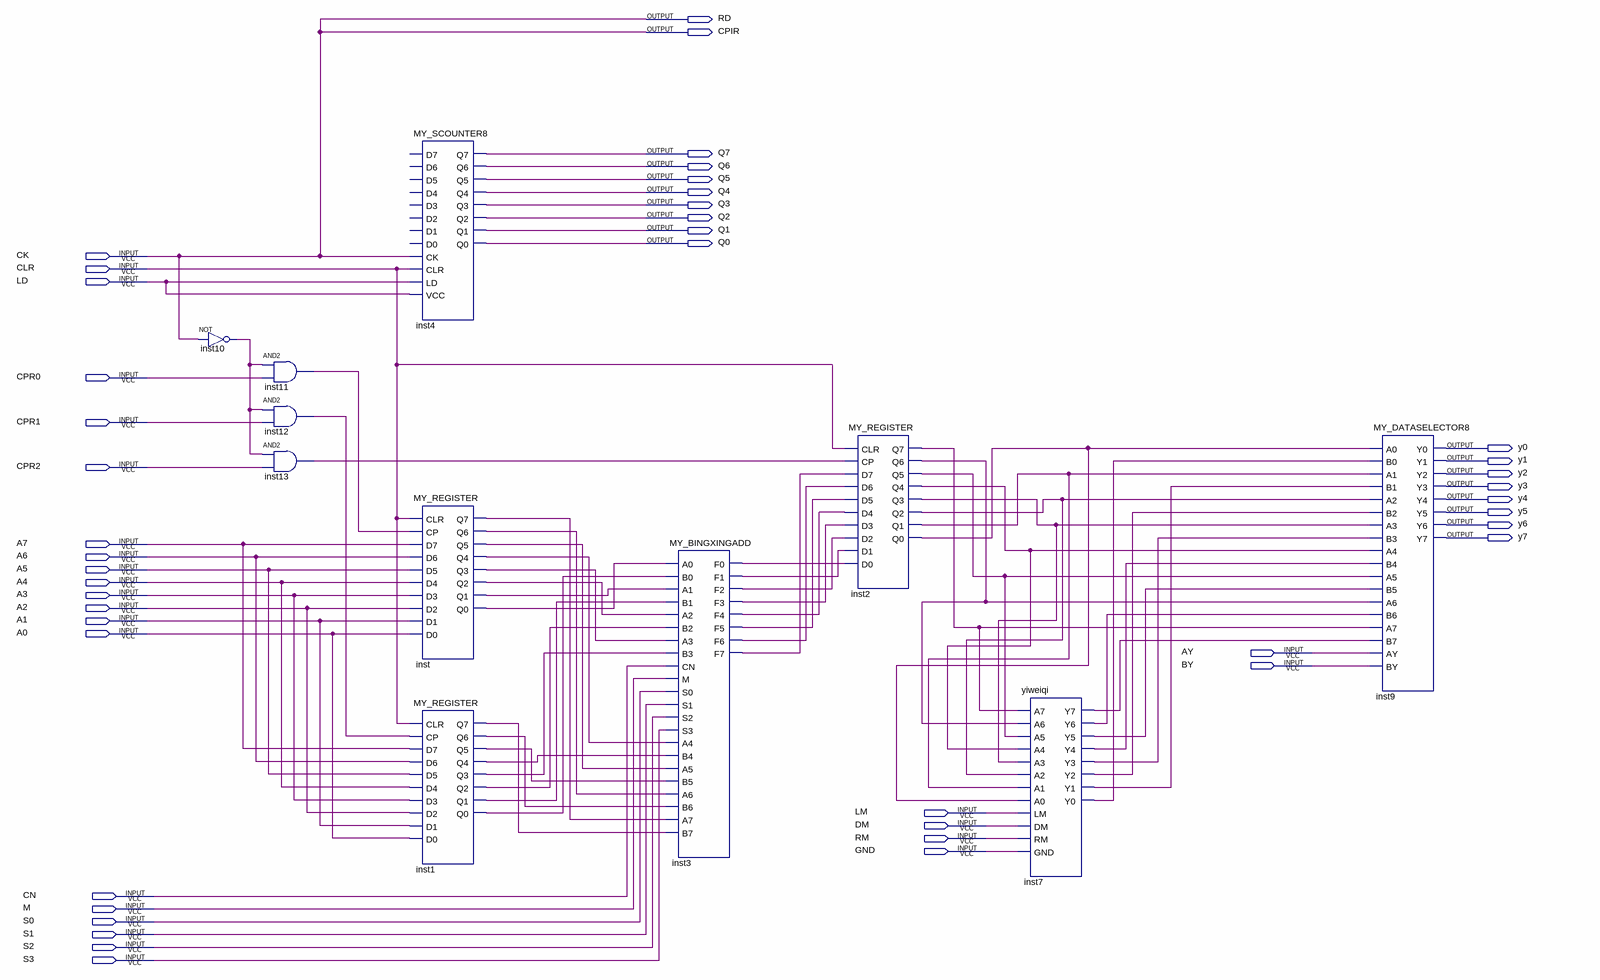
[diagram p0: schematic sheet]
// Quartus schematic MY_CONTROLEDADD.bdf as structural Verilog: 11 symbols, 44 pins
module MY_CONTROLEDADD (
  input  CK,
  input  CLR,
  input  LD,
  input  CPR0,
  input  CPR1,
  input  CPR2,
  input  A7,
  input  A6,
  input  A5,
  input  A4,
  input  A3,
  input  A2,
  input  A1,
  input  A0,
  input  AY,
  input  BY,
  input  LM,
  input  DM,
  input  RM,
  input  GND,
  input  CN,
  input  M,
  input  S0,
  input  S1,
  input  S2,
  input  S3,
  output RD,
  output CPIR,
  output Q7,
  output Q6,
  output Q5,
  output Q4,
  output Q3,
  output Q2,
  output Q1,
  output Q0,
  output y0,
  output y1,
  output y2,
  output y3,
  output y4,
  output y5,
  output y6,
  output y7
);

  wire inst1_q0, inst1_q1, inst1_q2, inst1_q3, inst1_q4, inst1_q5, inst1_q6, inst1_q7, inst2_q0, inst2_q1,
       inst2_q2, inst2_q3, inst2_q4, inst2_q5, inst2_q6, inst2_q7, inst3_f0, inst3_f1, inst3_f2, inst3_f3,
       inst3_f4, inst3_f5, inst3_f6, inst3_f7, inst7_y0, inst7_y1, inst7_y2, inst7_y3, inst7_y4, inst7_y5,
       inst7_y6, inst7_y7, inst10_out, inst11_out, inst12_out, inst13_out, inst_q0, inst_q1, inst_q2,
       inst_q3, inst_q4, inst_q5, inst_q6, inst_q7;

  not inst10 (inst10_out, CK);
  and inst11 (inst11_out, inst10_out, CPR0);
  and inst12 (inst12_out, inst10_out, CPR1);
  and inst13 (inst13_out, inst10_out, CPR2);
  MY_SCOUNTER8 inst4 (
    .CK(CK), .CLR(CLR), .LD(LD), .VCC(LD), .Q7(Q7), .Q6(Q6), .Q5(Q5), .Q4(Q4), .Q3(Q3), .Q2(Q2), .Q1(Q1),
    .Q0(Q0));  // open: D7, D6, D5, D4, D3, D2, D1, D0
  MY_REGISTER inst (
    .CLR(CLR), .CP(inst11_out), .D7(A7), .D6(A6), .D5(A5), .D4(A4), .D3(A3), .D2(A2), .D1(A1), .D0(A0),
    .Q7(inst_q7), .Q6(inst_q6), .Q5(inst_q5), .Q4(inst_q4), .Q3(inst_q3), .Q2(inst_q2), .Q1(inst_q1),
    .Q0(inst_q0));
  MY_REGISTER inst1 (
    .CLR(CLR), .CP(inst12_out), .D7(A7), .D6(A6), .D5(A5), .D4(A4), .D3(A3), .D2(A2), .D1(A1), .D0(A0),
    .Q7(inst1_q7), .Q6(inst1_q6), .Q5(inst1_q5), .Q4(inst1_q4), .Q3(inst1_q3), .Q2(inst1_q2), .Q1(inst1_q1),
    .Q0(inst1_q0));
  MY_BINGXINGADD inst3 (
    .A0(inst_q0), .B0(inst1_q0), .A1(inst_q1), .B1(inst1_q1), .A2(inst_q2), .B2(inst1_q2), .A3(inst_q3),
    .B3(inst1_q3), .CN(CN), .M(M), .S0(S0), .S1(S1), .S2(S2), .S3(S3), .A4(inst_q4), .B4(inst1_q4),
    .A5(inst_q5), .B5(inst1_q5), .A6(inst_q6), .B6(inst1_q6), .A7(inst_q7), .B7(inst1_q7), .F0(inst3_f0),
    .F1(inst3_f1), .F2(inst3_f2), .F3(inst3_f3), .F4(inst3_f4), .F5(inst3_f5), .F6(inst3_f6), .F7(inst3_f7));
  MY_REGISTER inst2 (
    .CLR(CLR), .CP(inst13_out), .D7(inst3_f7), .D6(inst3_f6), .D5(inst3_f5), .D4(inst3_f4), .D3(inst3_f3),
    .D2(inst3_f2), .D1(inst3_f1), .D0(inst3_f0), .Q7(inst2_q7), .Q6(inst2_q6), .Q5(inst2_q5), .Q4(inst2_q4),
    .Q3(inst2_q3), .Q2(inst2_q2), .Q1(inst2_q1), .Q0(inst2_q0));
  yiweiqi inst7 (
    .A7(inst2_q7), .A6(inst2_q6), .A5(inst2_q5), .A4(inst2_q4), .A3(inst2_q3), .A2(inst2_q2), .A1(inst2_q1),
    .A0(inst2_q0), .LM(LM), .DM(DM), .RM(RM), .GND(GND), .Y7(inst7_y7), .Y6(inst7_y6), .Y5(inst7_y5),
    .Y4(inst7_y4), .Y3(inst7_y3), .Y2(inst7_y2), .Y1(inst7_y1), .Y0(inst7_y0));
  MY_DATASELECTOR8 inst9 (
    .A0(inst2_q0), .B0(inst7_y0), .A1(inst2_q1), .B1(inst7_y1), .A2(inst2_q2), .B2(inst7_y2), .A3(inst2_q3),
    .B3(inst7_y3), .A4(inst2_q4), .B4(inst7_y4), .A5(inst2_q5), .B5(inst7_y5), .A6(inst2_q6), .B6(inst7_y6),
    .A7(inst2_q7), .B7(inst7_y7), .AY(AY), .BY(BY), .Y0(y0), .Y1(y1), .Y2(y2), .Y3(y3), .Y4(y4), .Y5(y5),
    .Y6(y6), .Y7(y7));

  assign CPIR = CK;
  assign RD = CK;
endmodule
